# Altium schematic sheet RFFE.SchDoc
size A; SheetNumber: 5; SheetTotal: 5
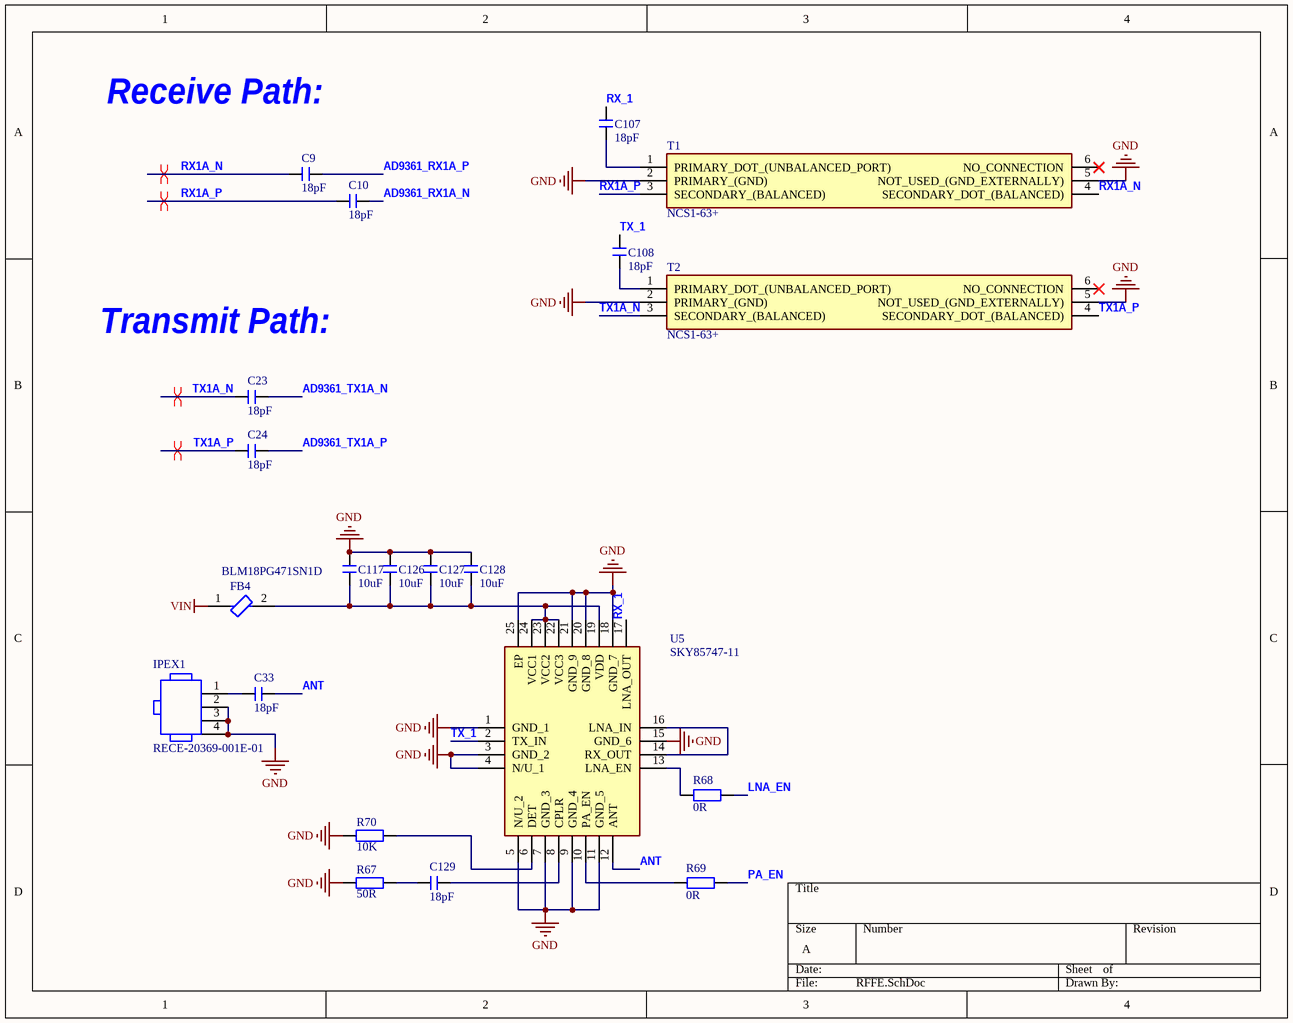
[diagram p0: RFFE.SchDoc]

## Parts
C9  18pF  [CAP_0201]
C10  18pF  [CAP_0201]
C23  18pF  [CAP_0201]
C24  18pF  [CAP_0201]
C33  18pF  [CAP_0201]
C107  18pF  [CAP_0201]
C108  18pF  [CAP_0201]
C117  10uF  [CAP_0402]
C126  10uF  [CAP_0402]
C127  10uF  [CAP_0402]
C128  10uF  [CAP_0402]
C129  18pF  [CAP_0201]
FB4  BLM18PG471SN1D  [FP-BLM18-0_15-t0_8-MFG]
IPEX1  RECE-20369-001E-01  [TG-RECE-20369-001E-4_V]
R67  value 50R  [RES_0201]  (hidden comment: Resistor)
R68  0R  [RES_0402]
R69  0R  [RES_0402]
R70  value 10K  [RES_0201]  (hidden comment: Resistor)
T1  NCS1-63+  [NCS163]
T2  NCS1-63+  [NCS163]
U5  SKY85747-11  [SKY8574711]

## Nets
GND: C117.2 C126.2 C127.2 C128.2 IPEX1.2 IPEX1.3 IPEX1.4 R67.2 R70.2 T1.2(PRIMARY_(GND)) T1.5(NOT_USED_(GND_EXTERNALLY)) T2.2(PRIMARY_(GND)) T2.5(NOT_USED_(GND_EXTERNALLY)) U5.1(GND_1) U5.3(GND_2) U5.4(N/U_1) U5.5(N/U_2) U5.7(GND_3) U5.9(GND_4) U5.11(GND_5) U5.15(GND_6) U5.18(GND_7) U5.20(GND_8) U5.21(GND_9) U5.25(EP)
VIN: FB4.1
AD9361_RX1A_N: C10.2
AD9361_RX1A_P: C9.2
AD9361_TX1A_N: C23.2
AD9361_TX1A_P: C24.2
ANT: C33.2 U5.12(ANT)
LNA_EN: R68.1
PA_EN: R69.1
RX1A_N: C9.1 T1.4(SECONDARY_DOT_(BALANCED))
RX1A_P: C10.1 T1.3(SECONDARY_(BALANCED))
RX_1: C107.2 U5.17(LNA_OUT)
TX1A_N: C23.1 T2.3(SECONDARY_(BALANCED))
TX1A_P: C24.1 T2.4(SECONDARY_DOT_(BALANCED))
TX_1: C108.2 U5.2(TX_IN)
NetC33_1: C33.1 IPEX1.1
NetC107_1: C107.1 T1.1(PRIMARY_DOT_(UNBALANCED_PORT))
NetC108_1: C108.1 T2.1(PRIMARY_DOT_(UNBALANCED_PORT))
NetC117_1: C117.1 C126.1 C127.1 C128.1 FB4.2 U5.19(VDD) U5.22(VCC3) U5.23(VCC2) U5.24(VCC1)
NetC129_1: C129.1 R67.1
NetC129_2: C129.2 U5.8(CPLR)
NetR68_2: R68.2 U5.13(LNA_EN)
NetR69_2: R69.2 U5.10(PA_EN)
NetR70_1: R70.1 U5.6(DET)
NetU5_14: U5.14(RX_OUT) U5.16(LNA_IN)

Not connected (* = marked no-connect by the designer): T1 6(NO_CONNECTION)*; T2 6(NO_CONNECTION)*

## Layout directives
differential pair: RX1A_N, RX1A_P, TX1A_N, TX1A_P

## Notes on the sheet
- Receive Path:
- Transmit Path:

## Library data of the parts
C9 C10 C23 C24 C33 C107 C108 C117 C126-C129 = C: 无极性贴片电容; 版权归属: 源创客; BOM名称: 无极性贴片电容; 学习资源: www.ooocke.com
FB4 = CMP-0686-00587-3: Chip Ferrite Bead, 0603, 470Ω @ 100MHz, 0.2Ω, 25%, 1A; DC Resistance (DCR): 200mR; Number of Circuits: 1; Material: Steel; Impedance: 470R; Core Material: Ferrite; Width: 0.8mm; Termination: SMD/SMT; Series: BLM18P; Min Operating Temperature: -55°C; DC Resistance-Max: 200mR; Current Rating: 1A; Package Quantity: 1; Max Operating Temperature: 125°C; Military Standard: Not; REACH SVHC: No SVHC; Max Current Rating: 1A; Number of Pins: 2; RoHS Compliant: Yes; Tolerance: 25%; Packaging: Tape and Reel; Number of Lines: 1; Resistance: 200mR; Length: 1.6mm; Case Code (Metric): 1608; Depth: 0.8mm; Lead Free: Lead Free; Case/Package: 0603; Height: 0.8mm; Radiation Hardening: No; Test Frequency: 100MHz; Case Code (Imperial): 0603; Max DC Current: 1A; DC Current: 1A
IPEX1 = CMP-0275-00001-2: RF Connector, Onboard Receptacle, IPEX MHFIII; Manufacturer: Taoglas; Packing: Tape and Reel; Mounting Technology: Surface Mount; PackageReference: RECE-20369-001E-01-4; ComponentLink1URL: http://www.taoglas.com/; Housing Color: Gold; DatasheetVersion: Rev. C; ComponentLink2URL: http://www.taoglas.com/images/product_images/original_images/RECE.20369.001E.01.pdf; ComponentLink3Description: Package Specification; PackageVersion: Rev. C; ComponentLink1Description: Manufacturer URL; ComponentLink2Description: Datasheet; PackageDescription: 4-Pin, Hand Drawn, Body 1.7x1.7mm; ComponentLink3URL: http://www.taoglas.com/images/product_images/original_images/RECE.20369.001E.01.pdf; PartNumber: RECE-20369-001E-01
R68 R69 = R: 贴片电阻; 版权归属: 源创客; BOM名称: 贴片电阻; 学习资源: www.ooocke.com
T1 T2 = NCS1-63+: Transformer; Manufacturer_Name: Mini-Circuits; Datasheet Link: https://www.minicircuits.com/pdfs/NCS1-63+.pdf; Height: 1.0686mm; Manufacturer_Part_Number: NCS1-63+; Mouser Part Number: 139-NCS1-63; Mouser Price/Stock: https://www.mouser.co.uk/ProductDetail/Mini-Circuits/NCS1-63%2b?qs=xZ%2FP%252Ba9zWqbvv4L0HdNEiw%3D%3D
U5 = SKY85747-11: Integrated Circuit; Manufacturer_Name: Skyworks; Datasheet Link: https://www.skyworksinc.com/-/media/D3029C8735D243D49E5D7B71E89CB849.pdf; Height: 1mm; Manufacturer_Part_Number: SKY85747-11; Mouser Part Number: N/A; Mouser Price/Stock: https://www.mouser.co.uk/ProductDetail/Skyworks-Solutions-Inc/SKY85747-11?qs=rkhjVJ6%2F3EJ7jYNOizWTJw%3D%3D